# Altium schematic sheet drv8323.SchDoc: MDRV
size A4; Date: 02.10.2025; CheckedBy: BCY; DrawnBy: miaow; DocumentNumber: 3; Revision: v0.0.1; SheetNumber: 3; SheetTotal: 12; Sample: A0; Url: github.com/miaow-cn/pcb-lib; Liscense: GPLv3; Board: MIAOW FOC BOARD; BoardType: MAIN_PCB; Desc: 3-bridge motor driver
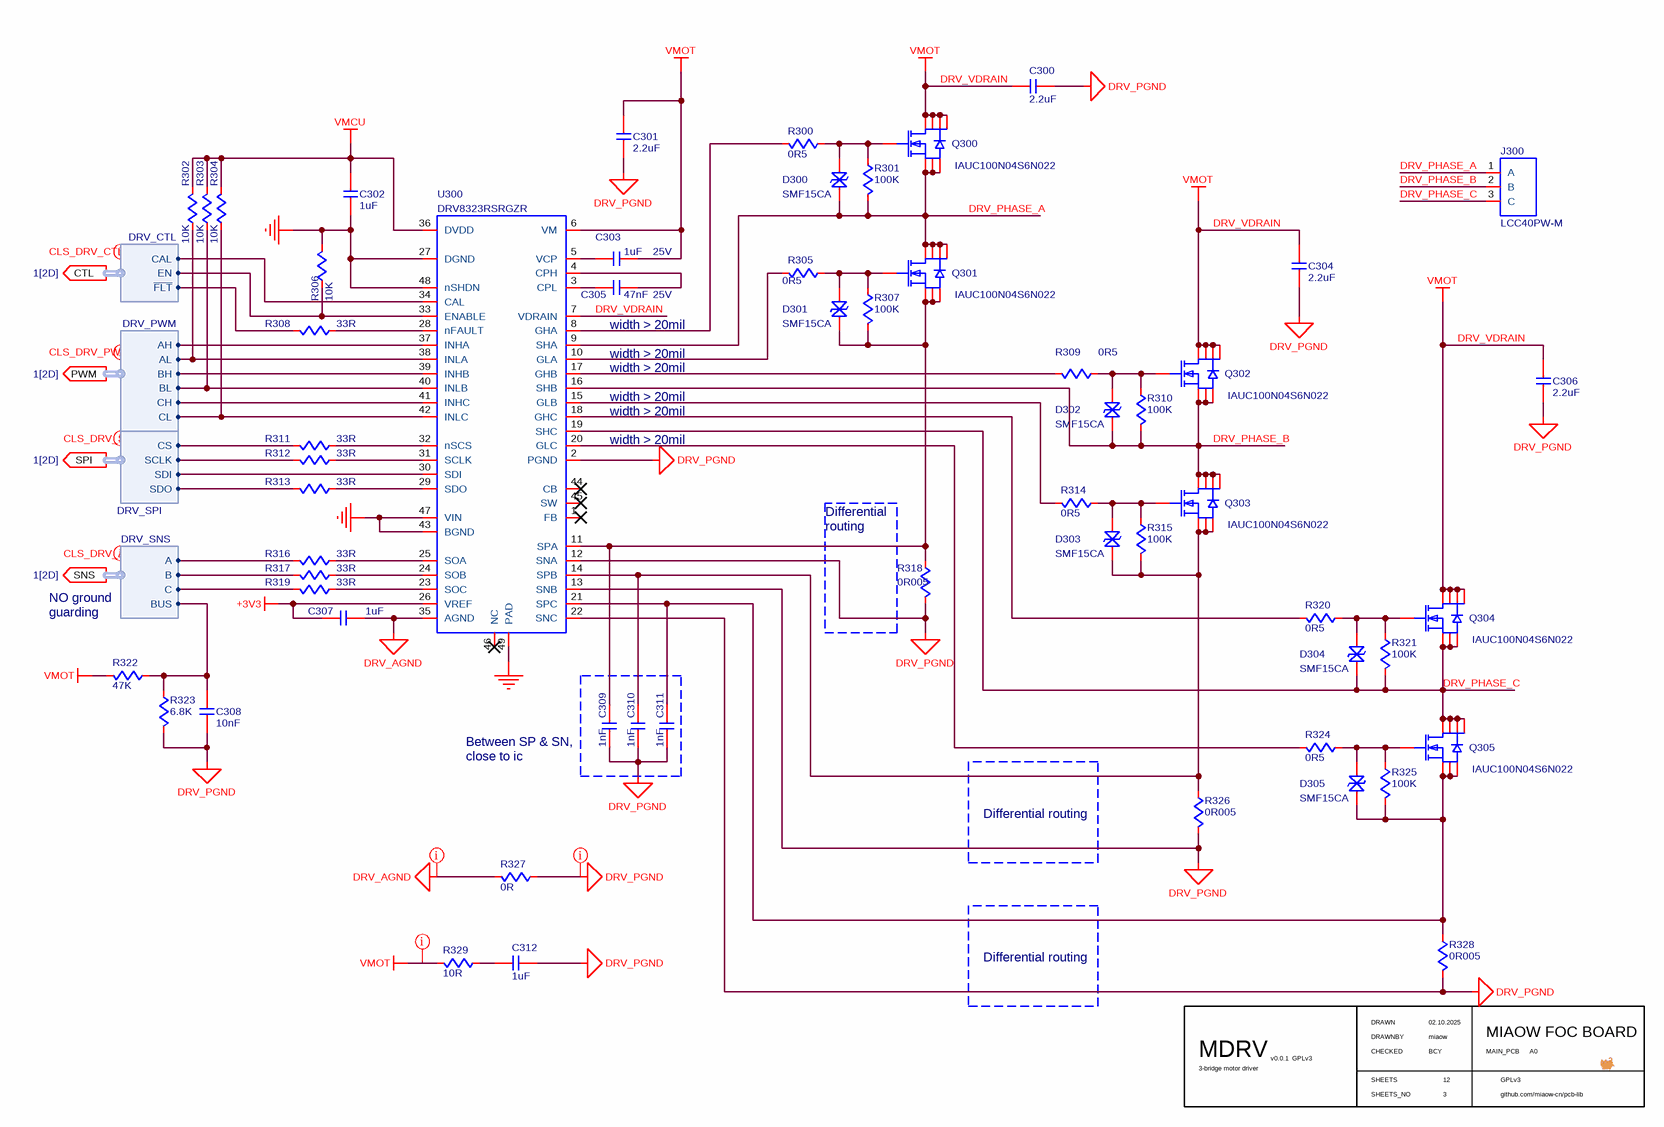
[diagram p0: drv8323.SchDoc]

## Parts
C300  value 2.2uF  [C0603]  (hidden comment: C-NOMO)
C301  value 2.2uF  [C0603]  (hidden comment: C-NOMO)
C302  value 1uF  [C0603]  (hidden comment: C-NOMO)
C303  value 1uF  voltage: 25V  [C0603]  (hidden comment: C-NOMO)
C304  value 2.2uF  [C0603]  (hidden comment: C-NOMO)
C305  value 47nF  voltage: 25V  [C0805]  (hidden comment: C-NOMO)
C306  value 2.2uF  [C0603]  (hidden comment: C-NOMO)
C307  value 1uF  [C0603]  (hidden comment: C-NOMO)
C308  value 10nF  [C0603]  (hidden comment: C-NOMO)
C309  value 1nF  [C0402]  (hidden comment: C-NOMO)
C310  value 1nF  [C0402]  (hidden comment: C-NOMO)
C311  value 1nF  [C0402]  (hidden comment: C-NOMO)
C312  value 1uF  [C0603]  (hidden comment: C-NOMO)
D300  SMF15CA  [SMF15CA]
D301  SMF15CA  [SMF15CA]
D302  SMF15CA  [SMF15CA]
D303  SMF15CA  [SMF15CA]
D304  SMF15CA  [SMF15CA]
D305  SMF15CA  [SMF15CA]
J300  LCC40PW-M  [LCC40PW-M]
Q300  IAUC100N04S6N022  [IAUC100N04S6N022]
Q301  IAUC100N04S6N022  [IAUC100N04S6N022]
Q302  IAUC100N04S6N022  [IAUC100N04S6N022]
Q303  IAUC100N04S6N022  [IAUC100N04S6N022]
Q304  IAUC100N04S6N022  [IAUC100N04S6N022]
Q305  IAUC100N04S6N022  [IAUC100N04S6N022]
R300  value 0R5  [R0805]  (hidden comment: R)
R301  value 100K  [R0603]  (hidden comment: R)
R302  value 10K  [R0402]  (hidden comment: R)
R303  value 10K  [R0402]  (hidden comment: R)
R304  value 10K  [R0402]  (hidden comment: R)
R305  value 0R5  [R0805]  (hidden comment: R)
R306  value 10K  [R0402]  (hidden comment: R)
R307  value 100K  [R0603]  (hidden comment: R)
R308  value 33R  [R0402]  (hidden comment: R)
R309  value 0R5  [R0805]  (hidden comment: R)
R310  value 100K  [R0603]  (hidden comment: R)
R311  value 33R  [R0402]  (hidden comment: R)
R312  value 33R  [R0402]  (hidden comment: R)
R313  value 33R  [R0402]  (hidden comment: R)
R314  value 0R5  [R0805]  (hidden comment: R)
R315  value 100K  [R0603]  (hidden comment: R)
R316  value 33R  [R0402]  (hidden comment: R)
R317  value 33R  [R0402]  (hidden comment: R)
R318  value 0R005  [R2512]  (hidden comment: R)
R319  value 33R  [R0402]  (hidden comment: R)
R320  value 0R5  [R0805]  (hidden comment: R)
R321  value 100K  [R0603]  (hidden comment: R)
R322  value 47K  [R0603]  (hidden comment: R)
R323  value 6.8K  [R0603]  (hidden comment: R)
R324  value 0R5  [R0805]  (hidden comment: R)
R325  value 100K  [R0603]  (hidden comment: R)
R326  value 0R005  [R2512]  (hidden comment: R)
R327  value 0R  [R0805]  (hidden comment: R)
R328  value 0R005  [R2512]  (hidden comment: R)
R329  value 10R  [R0603]  (hidden comment: R)
U300  DRV8323RSRGZR  [DRV8323RSRGZR]

## Ports
CTL (out, harness DRV_CTL, see 1[2D]), PWM (out, harness DRV_PWM, see 1[2D]), SNS (out, harness DRV_SNS, see 1[2D]), SPI (out, harness DRV_SPI, see 1[2D])

## Harnesses
DRV_CTL: CAL, EN, ~{FLT}
DRV_SNS: C, B, A, BUS
DRV_SPI: CS, SCLK, SDI, SDO
DRV_PWM: AH, AL, BH, BL, CH, CL

## Nets
+3V3: C307.1 U300.26(VREF)
DRV_AGND: C307.2 R327.1 U300.35(AGND)
DRV_PGND: C300.1 C301.1 C304.1 C306.1 C308.2 C309.1 C310.1 C311.1 C312.1 R318.1 R323.1 R326.1 R327.2 R328.1 U300.2(PGND) U300.12(SNA) U300.13(SNB) U300.22(SNC)
DRV_VDRAIN: C300.2 C301.2 C303.2 C304.2 C306.2 Q300.5(D) Q300.6(D) Q300.7(D) Q300.8(D) Q302.5(D) Q302.6(D) Q302.7(D) Q302.8(D) Q304.5(D) Q304.6(D) Q304.7(D) Q304.8(D) R322.1 R329.1 U300.6(VM) U300.7(VDRAIN)  [also labelled VMOT]
GND: C302.1 R306.1 U300.27(DGND) U300.43(BGND) U300.47(VIN) U300.48(nSHDN) U300.49(PAD)
VMCU: C302.2 R302.1 R303.1 R304.1 U300.36(DVDD)
DRV_PHASE_A: D300.1 J300.1(A) Q300.1(S) Q300.2(S) Q300.3(S) Q301.5(D) Q301.6(D) Q301.7(D) Q301.8(D) R301.1 U300.9(SHA)
DRV_PHASE_B: D302.1 J300.2(B) Q302.1(S) Q302.2(S) Q302.3(S) Q303.5(D) Q303.6(D) Q303.7(D) Q303.8(D) R310.1 U300.16(SHB)
DRV_PHASE_C: D304.1 J300.3(C) Q304.1(S) Q304.2(S) Q304.3(S) Q305.5(D) Q305.6(D) Q305.7(D) Q305.8(D) R321.1 U300.19(SHC)
NetC303_1: C303.1 U300.5(VCP)
NetC305_1: C305.1 U300.3(CPL)
NetC305_2: C305.2 U300.4(CPH)
NetC308_1: C308.1 R322.2 R323.2 ; port SNS.BUS
NetC309_2: C309.2 D301.1 Q301.1(S) Q301.2(S) Q301.3(S) R307.1 R318.2 U300.11(SPA)
NetC310_2: C310.2 D303.1 Q303.1(S) Q303.2(S) Q303.3(S) R315.1 R326.2 U300.14(SPB)
NetC311_2: C311.2 D305.1 Q305.1(S) Q305.2(S) Q305.3(S) R325.1 R328.2 U300.21(SPC)
NetC312_2: C312.2 R329.2
NetD300_2: D300.2 Q300.4(G) R300.2 R301.2
NetD301_2: D301.2 Q301.4(G) R305.2 R307.2
NetD302_2: D302.2 Q302.4(G) R309.2 R310.2
NetD303_2: D303.2 Q303.4(G) R314.2 R315.2
NetD304_2: D304.2 Q304.4(G) R320.2 R321.2
NetD305_2: D305.2 Q305.4(G) R324.2 R325.2
NetR300_1: R300.1 U300.8(GHA)
NetR302_2: R302.2 U300.38(INLA) ; port PWM.AL
NetR303_2: R303.2 U300.40(INLB) ; port PWM.BL
NetR304_2: R304.2 U300.42(INLC) ; port PWM.CL
NetR305_1: R305.1 U300.10(GLA)
NetR306_2: R306.2 U300.33(ENABLE) ; port CTL.EN
NetR308_1: R308.1 ; port CTL.~{FLT}
NetR308_2: R308.2 U300.28(nFAULT)
NetR309_1: R309.1 U300.17(GHB)
NetR311_1: R311.1 ; port SPI.CS
NetR311_2: R311.2 U300.32(nSCS)
NetR312_1: R312.1 ; port SPI.SCLK
NetR312_2: R312.2 U300.31(SCLK)
NetR313_1: R313.1 ; port SPI.SDO
NetR313_2: R313.2 U300.29(SDO)
NetR314_1: R314.1 U300.15(GLB)
NetR316_1: R316.1 ; port SNS.A
NetR316_2: R316.2 U300.25(SOA)
NetR317_1: R317.1 ; port SNS.B
NetR317_2: R317.2 U300.24(SOB)
NetR319_1: R319.1 ; port SNS.C
NetR319_2: R319.2 U300.23(SOC)
NetR320_1: R320.1 U300.18(GHC)
NetR324_1: R324.1 U300.20(GLC)
NetU300_30: U300.30(SDI) ; port SPI.SDI
NetU300_34: U300.34(CAL) ; port CTL.CAL
NetU300_37: U300.37(INHA) ; port PWM.AH
NetU300_39: U300.39(INHB) ; port PWM.BH
NetU300_41: U300.41(INHC) ; port PWM.CH

Not connected (* = marked no-connect by the designer): U300 1(FB)* 44(CB)* 45(SW)* 46(NC)*

## Layout directives
net class CLS_PWR: DRV_AGND, DRV_PGND, DRV_VDRAIN
net class CLS_DRV_AN: (no net found under the mark)
net class CLS_DRV_SPI: (no net found under the mark)
net class CLS_DRV_PWM: (no net found under the mark)
net class CLS_DRV_CTL: (no net found under the mark)

## Notes on the sheet
- width > 20mil
- (near U300) width > 20mil
- (near R318) Differential routing
- (near R322) NO ground guarding
- (near C309) Between SP & SN, close to ic
- Differential routing
- DRAWN
- CHECKED
- DRAWNBY
- SHEETS
- SHEETS_NO

## Library data of the parts
C300-C302 C304 C306-C312 = C-NOMO: voltage: 25V; precision: 5%
C303 C305 = C-NOMO: precision: 5%
D300-D305 = SMF15CA: TVS/ESD; Supplier 1: LCSC; Supplier Part Number 1: C123803
J300 = LCC40PW-M: CONNECTOR - 3pin, power; Supplier 1: LCSC; Supplier Part Number 1: C7437310
R300-R329 = R: precision: 1%
Q300-Q305 = IAUC100N04S6N022: Supplier 1: LCSC; Supplier Part Number 1: C535695
U300 = DRV8323RSRGZR: Supplier 1: LCSC; Supplier Part Number 1: C545497